# EAGLE design PSocC Motor Driver Design 2 (EAGLE 7.5.0)
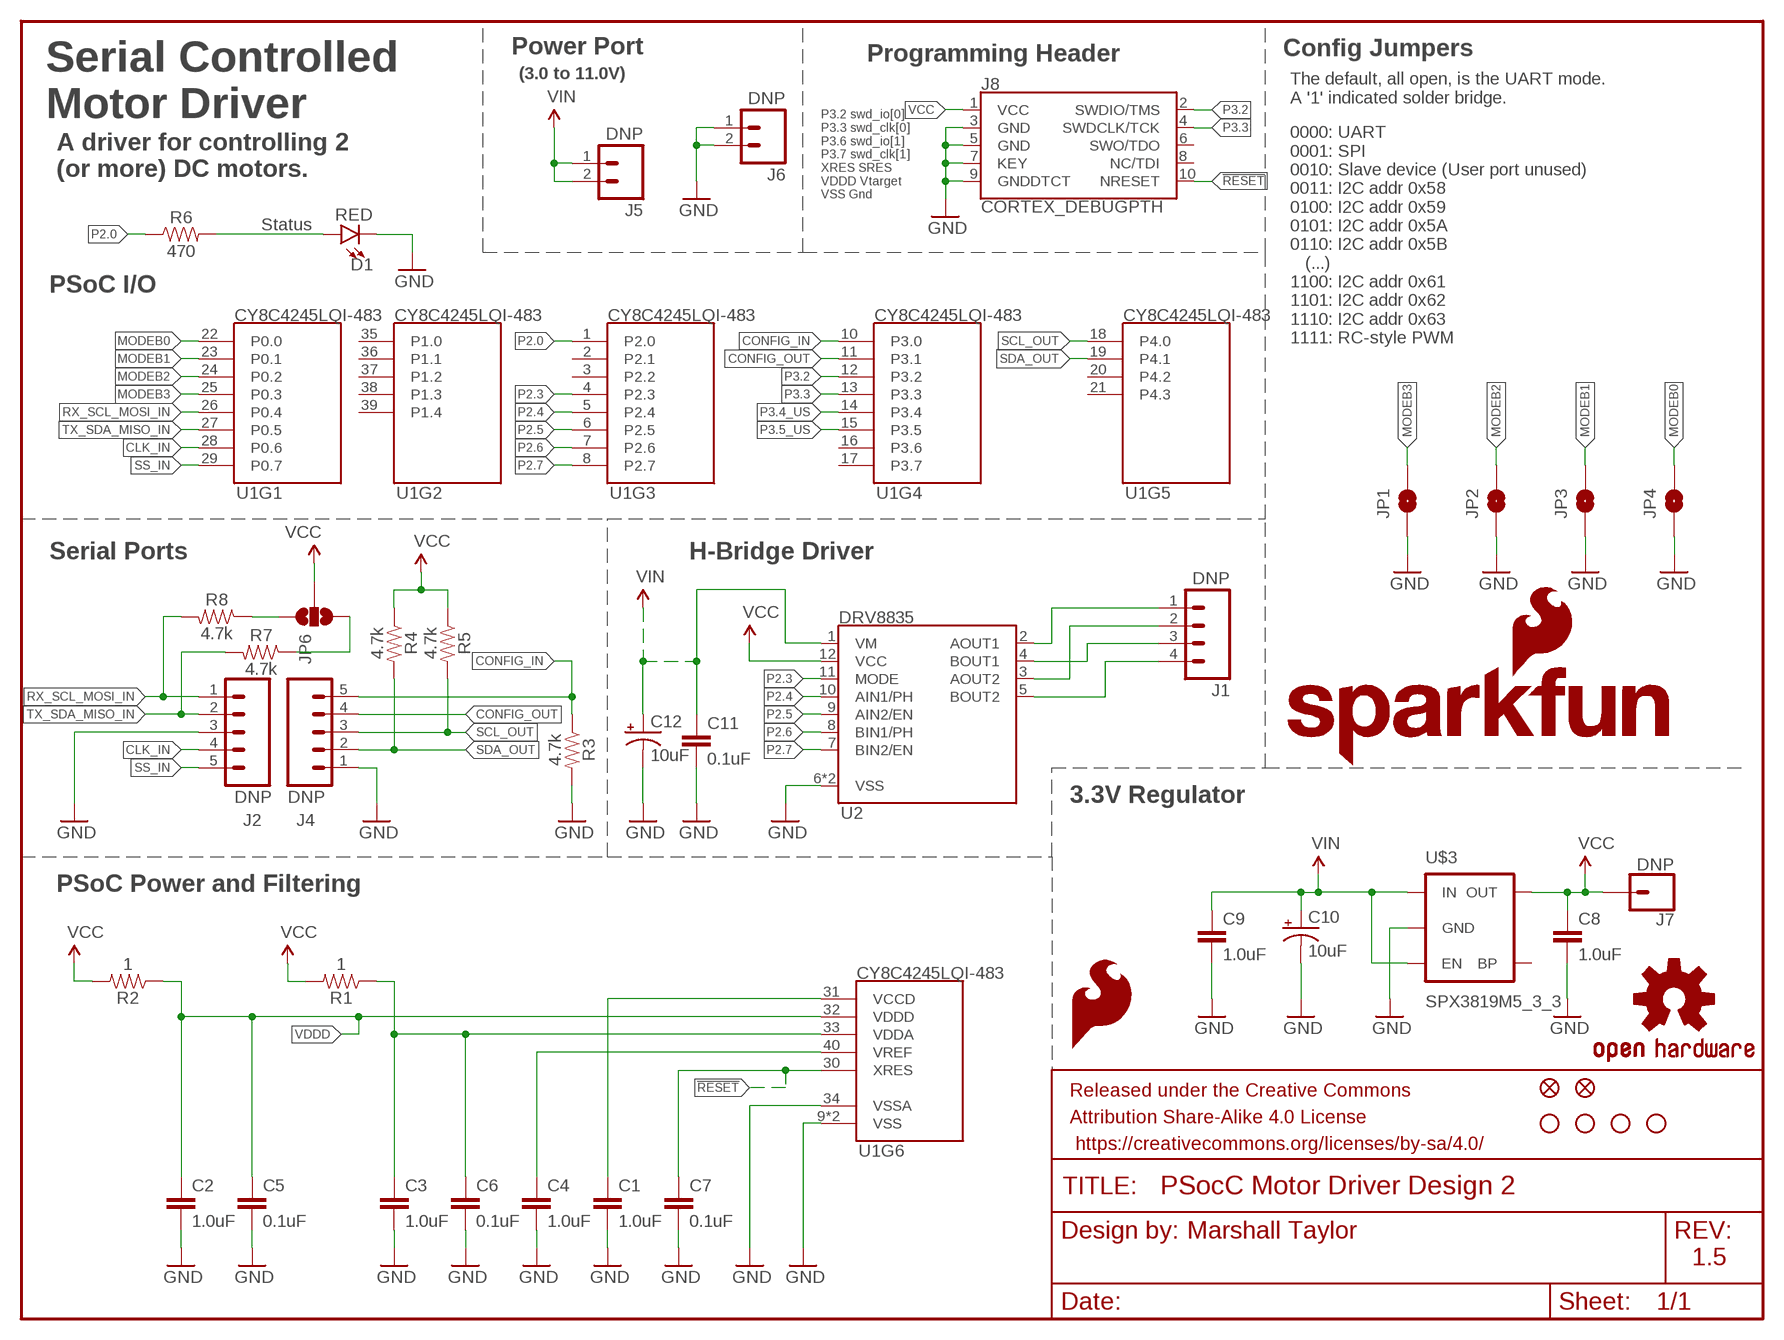
[diagram p0: schematic, sheet 1]

## Parts
C1  1.0uF  1.0UF-0402-16V-10%  [0402]
C2  1.0uF  1.0UF-0402-16V-10%  [0402]
C3  1.0uF  1.0UF-0402-16V-10%  [0402]
C4  1.0uF  1.0UF-0402-16V-10%  [0402]
C5  0.1uF  0.1UF-0402-16V-10%  [0402]
C6  0.1uF  0.1UF-0402-16V-10%  [0402]
C7  0.1uF  0.1UF-0402-16V-10%  [0402]
C8  1.0uF  1.0UF-0402-16V-10%  [0402]
C9  1.0uF  1.0UF-0402-16V-10%  [0402]
C10  10uF  10UF-POLAR-EIA3216-16V-10%(TANT)  [EIA3216]
C11  0.1uF  0.1UF-0402-16V-10%  [0402]
C12  10uF  10UF-POLAR-EIA3216-16V-10%(TANT)  [EIA3216]
D1  RED  LED-RED0603  [LED-0603]
FD1  FIDUCIALUFIDUCIAL  [MICRO-FIDUCIAL]
FD2  FIDUCIALUFIDUCIAL  [MICRO-FIDUCIAL]
FRAME1  FRAME-LETTER  [CREATIVE_COMMONS]
H1  STAND-OFF  [STAND-OFF]
H2  STAND-OFF  [STAND-OFF]
H3  STAND-OFF  [STAND-OFF]
H4  STAND-OFF  [STAND-OFF]
J1  DNP  M04PTH  [1X04]
J2  DNP  M05PTH  [1X05]
J4  DNP  M05PTH  [1X05]
J5  DNP  M02PTH  [1X02]
J6  DNP  M02PTH  [1X02]
J7  DNP  CONN_01PTH  [1X01]
J8  CORTEX_DEBUGPTH  [2X5-PTH-1.27MM]
JP1  JUMPER-PAD-2  JUMPER-PAD-2-NOYES_SILK  [PAD-JUMPER-2-NO_YES_SILK]
JP2  JUMPER-PAD-2  JUMPER-PAD-2-NOYES_SILK  [PAD-JUMPER-2-NO_YES_SILK]
JP3  JUMPER-PAD-2  JUMPER-PAD-2-NOYES_SILK  [PAD-JUMPER-2-NO_YES_SILK]
JP4  JUMPER-PAD-2  JUMPER-PAD-2-NOYES_SILK  [PAD-JUMPER-2-NO_YES_SILK]
JP6  JUMPER-PAD-3-NOYES_SILK  [PAD-JUMPER-3-NO_YES_SILK]
LOGO1  SFE_LOGO_FLAME.1_INCH  [SFE_LOGO_FLAME_.1]
LOGO2  OSHW-LOGOMINI  [OSHW-LOGO-MINI]
LOGO3  SFE_LOGO_NAME_FLAME.1_INCH  [SFE_LOGO_NAME_FLAME_.1]
R1  1  1OHM-0603-1/10W-1%  [0603]
R2  1  1OHM-0603-1/10W-1%  [0603]
R3  4.7k  4.7KOHM-0603-1/10W-1%  [0603]
R4  4.7k  4.7KOHM-0603-1/10W-1%  [0603]
R5  4.7k  4.7KOHM-0603-1/10W-1%  [0603]
R6  470  470OHM-0603-1/10W-1%  [0603]
R7  4.7k  4.7KOHM-0603-1/10W-1%  [0603]
R8  4.7k  4.7KOHM-0603-1/10W-1%  [0603]
U1  CY8C4245LQI-483  CY8C4245LQI  [QFN-40]
U2  DRV8835  DRV883X  [WSON-12]
U$3  SPX3819M5_3_3  SPX3819  [SOT-23-5-VREG]

## Nets
!RESET: C7.1 J8.10(NRESET) U1.30(XRES)
CLK_IN: J2.4 U1.28(P0.6)
CONFIG_IN: J4.5 R3.1 U1.10(P3.0)
CONFIG_OUT: J4.4 U1.11(P3.1)
GND: C1.2 C2.2 C3.2 C4.2 C5.2 C6.2 C7.2 C8.2 C9.2 C10.- C11.2 C12.- D1.C J2.3 J4.1 J6.1 J6.2 J8.3(GND) J8.5(GND) J8.7(KEY) J8.9(GNDDTCT) JP1.1 JP2.1 JP3.1 JP4.1 R3.2 U1.9(VSS) U1.34(VSSA) U1.EP(VSS) U2.6(VSS) U2.PAD(VSS) U$3.2(GND)
MODEB0: JP4.2 U1.22(P0.0)
MODEB1: JP3.2 U1.23(P0.1)
MODEB2: JP2.2 U1.24(P0.2)
MODEB3: JP1.2 U1.25(P0.3)
N$1: C1.1 U1.31(VCCD)
N$3: C3.1 C6.1 R1.1 U1.33(VDDA)
N$4: C4.1 U1.40(VREF)
N$5: J1.1 U2.2(AOUT1)
N$6: J1.2 U2.3(AOUT2)
N$7: J1.3 U2.4(BOUT1)
N$8: J1.4 U2.5(BOUT2)
N$10: D1.A R6.2
N$11: JP6.1 R8.1
N$12: JP6.3 R7.1
P2.0: R6.1 U1.1(P2.0)
P2.3: U1.4(P2.3) U2.11(MODE)
P2.4: U1.5(P2.4) U2.10(AIN1/PH)
P2.5: U1.6(P2.5) U2.9(AIN2/EN)
P2.6: U1.7(P2.6) U2.8(BIN1/PH)
P2.7: U1.8(P2.7) U2.7(BIN2/EN)
P3.2: J8.2(SWDIO/TMS) U1.12(P3.2)
P3.3: J8.4(SWDCLK/TCK) U1.13(P3.3)
P3.4_US: U1.14(P3.4)
P3.5_US: U1.15(P3.5)
RX_SCL_MOSI_IN: J2.1 R8.2 U1.26(P0.4)
SCL_OUT: J4.3 R5.2 U1.18(P4.0)
SDA_OUT: J4.2 R4.2 U1.19(P4.1)
SS_IN: J2.5 U1.29(P0.7)
TX_SDA_MISO_IN: J2.2 R7.2 U1.27(P0.5)
VCC: C8.1 J7.1 J8.1(VCC) JP6.2 R1.2 R2.2 R4.1 R5.1 U2.12(VCC) U$3.5(OUT)
VDDD: C2.1 C5.1 R2.1 U1.32(VDDD)
VIN: C9.1 C10.+ C11.1 C12.+ J5.1 J5.2 U2.1(VM) U$3.1(IN) U$3.3(EN)
Unconnected: J8.6(SWO/TDO) J8.8(NC/TDI) U1.2(P2.1) U1.3(P2.2) U1.16(P3.6) U1.17(P3.7) U1.20(P4.2) U1.21(P4.3) U1.35(P1.0) U1.36(P1.1) U1.37(P1.2) U1.38(P1.3) U1.39(P1.4) U$3.4(BP)

## Notes on the sheet
- Serial Controlled
  Motor Driver
- Power Port | Programming Header | Config Jumpers
- The default, all open, is the UART mode.
  A '1' indicated solder bridge.
- (3.0 to 11.0V)
- P3.2 swd_io[0]
  P3.3 swd_clk[0]
  P3.6 swd_io[1]
  P3.7 swd_clk[1]
  XRES SRES
  VDDD Vtarget
  VSS Gnd
- 0000: UART
  0001: SPI
  0010: Slave device (User port unused)
  0011: I2C addr 0x58
  0100: I2C addr 0x59
  0101: I2C addr 0x5A
  0110: I2C addr 0x5B
     (...)
  1100: I2C addr 0x61
  1101: I2C addr 0x62
  1110: I2C addr 0x63
  1111: RC-style PWM
- A driver for controlling 2
  (or more) DC motors.
- Status
- PSoC I/O
- Serial Ports | H-Bridge Driver
- 3.3V Regulator
- PSoC Power and Filtering
- Marshall Taylor
- 1.5

## Library data of the parts
C1-C4 C8 C9 = SparkFun-Capacitors:1.0UF: 1µF ceramic capacitors A capacitor is a passive two-terminal electrical component used to store electrical energy temporarily in an electric field.; PROD_ID: CAP-12417
C5-C7 C11 = SparkFun-Capacitors:0.1UF: 0.1µF ceramic capacitors A capacitor is a passive two-terminal electrical component used to store electrical energy temporarily in an electric field.; PROD_ID: CAP-12416
C10 C12 = SparkFun-Capacitors:10UF-POLAR: 10.0µF polarized capacitors A capacitor is a passive two-terminal electrical component used to store electrical energy temporarily in an electric field.; PROD_ID: CAP-00811
D1 = SparkFun-LED:LED-RED: Red SMD LED Used in manufacturing of most products at SparkFun Packages: 0603 - SMD 0603 package [Product Link] <http://docs.avagotech.com/docs/AV02-0551EN> 0603 SMART - SMD 0603 SMART package ( more efficient and expensive)[Product Link] <http://www.osram-os.com/Graphics/XPic2/00077099_0.pdf> 1206 - SMD1206 package [Product Link] <https://www.sparkfun.com/datasheets/DevTools/LilyPad/Q150OVS4.pdff> SparkFun Products: Pro Mini 328 -5V <https://www.sparkfun.com/products/821> RedBoard <https://www.sparkfun.com/products/12757> IOIO-OTG <https://www.sparkfun.com/products/13613>; PROD_ID: DIO-00819
FD1 FD2 = SparkFun-Aesthetics:FIDUCIAL: Fiducial Alignment Points Various fiducial points for machine vision alignment.
FRAME1 = SparkFun-Aesthetics:FRAME-LETTER: Schematic Frame Standard 8.5x11 US Letter frame
H1-H4 = SparkFun-Electromechanical:STAND-OFF: #4 Stand Off This is the mechanical footprint for a #4 phillips button head screw. Use the keepout ring to avoid running the screw head into surrounding components. SKU : PRT-00447
J1 = SparkFun-Connectors:M04: Header 4 Standard 4-pin 0.1" header. Use with straight break away headers (SKU : PRT-00116), right angle break away headers (PRT-00553), swiss pins (PRT-00743), machine pins (PRT-00117), and female headers (PRT-00115). Molex polarized connector foot print use with SKU : PRT-08231 with associated crimp pins and housings. 1MM SMD Version SKU: PRT-10208; PROD_ID: CONN-09696
J2 J4 = SparkFun-Connectors:M05: Header 5 Standard 5-pin 0.1" header. Use with straight break away headers (SKU : PRT-00116), right angle break away headers (PRT-00553), swiss pins (PRT-00743), machine pins (PRT-00117), and female headers (PRT-00115). Molex polarized connector foot print use with SKU : PRT-08230 with associated crimp pins and housings.
J5 J6 = SparkFun-Connectors:M02: Standard 2-pin 0.1" header. Use with - straight break away headers ( PRT-00116) - right angle break away headers (PRT-00553) - swiss pins (PRT-00743) - machine pins (PRT-00117) - female headers (PRT-00115) Molex polarized connector foot print use with: PRT-08233 with associated crimp pins and housings. 2.54_SCREWTERM for use with PRT-10571. 3.5mm Screw Terminal footprints for PRT-08084 5mm Screw Terminal footprints for use with PRT-08432
J7 = SparkFun-Connectors:CONN_01: Header 1 Standard 1-pin 0.1" header. Use with straight break away headers (SKU : PRT-00116), right angle break away headers (PRT-00553), swiss pins (PRT-00743), machine pins (PRT-00117), and female headers (PRT-00115). SMTSO-256-ET is a "flush mount" nut for a 4-40 screw. The older package used to be too tight, and did not allow it to sit properly thru the drill hit. The latest (0.165DIA) fits nice and snug.
J8 = Pete_Connectors_Retired:CORTEX_DEBUG: Cortex Debug Connector Datasheet <http://infocenter.arm.com/help/topic/com.arm.doc.faqs/attached/13634/cortex_debug_connectors.pdf>
JP1-JP4 = SparkFun-Passives:JUMPER-PAD-2-NO
JP6 = SparkFun-Passives:JUMPER-PAD-3-NO
LOGO1 = SparkFun-Aesthetics:SFE_LOGO_FLAME: SFE Logo, flame only This is the SparkFun flame logo. The logo on the schematic will always be the same size; the package variant is the height of the flame. Default layer for the logo on the board is tSilk.
LOGO2 = SparkFun-Aesthetics:OSHW-LOGO: Open Source Hardware Logo This logo indicates the piece of hardware it is found on incorporates a OSHW license and/or adheres to the definition of open source hardware found here: http://freedomdefined.org/OSHW
LOGO3 = SparkFun-Aesthetics:SFE_LOGO_NAME_FLAME: SFE Logo, name and flame This is the SparkFun full logo. The logo on the schematic will always be the same size; the package variant is the height of the flame part of the logo. Default layer for the logo on the board is tSilk.
R1 R2 = SparkFun-Resistors:1OHM: 1Ω resistor A resistor is a passive two-terminal electrical component that implements electrical resistance as a circuit element. Resistors act to reduce current flow, and, at the same time, act to lower voltage levels within circuits.; PROD_ID: RES-08269
R3-R5 R7 R8 = SparkFun-Resistors:4.7KOHM: 4.7kΩ resistor A resistor is a passive two-terminal electrical component that implements electrical resistance as a circuit element. Resistors act to reduce current flow, and, at the same time, act to lower voltage levels within circuits.; PROD_ID: RES-07857
R6 = SparkFun-Resistors:470OHM: 470Ω resistor A resistor is a passive two-terminal electrical component that implements electrical resistance as a circuit element. Resistors act to reduce current flow, and, at the same time, act to lower voltage levels within circuits.; PROD_ID: RES-07869
U1 = PSOC4TempLib:CY8C4245LQI: PSOC 4200; PROD_ID: IC-13292
U2 = PSOC4TempLib:DRV883X; PROD_ID: IC-13342
U$3 = PSOC4TempLib:SPX3819; PROD_ID: VREG-13321

## Board
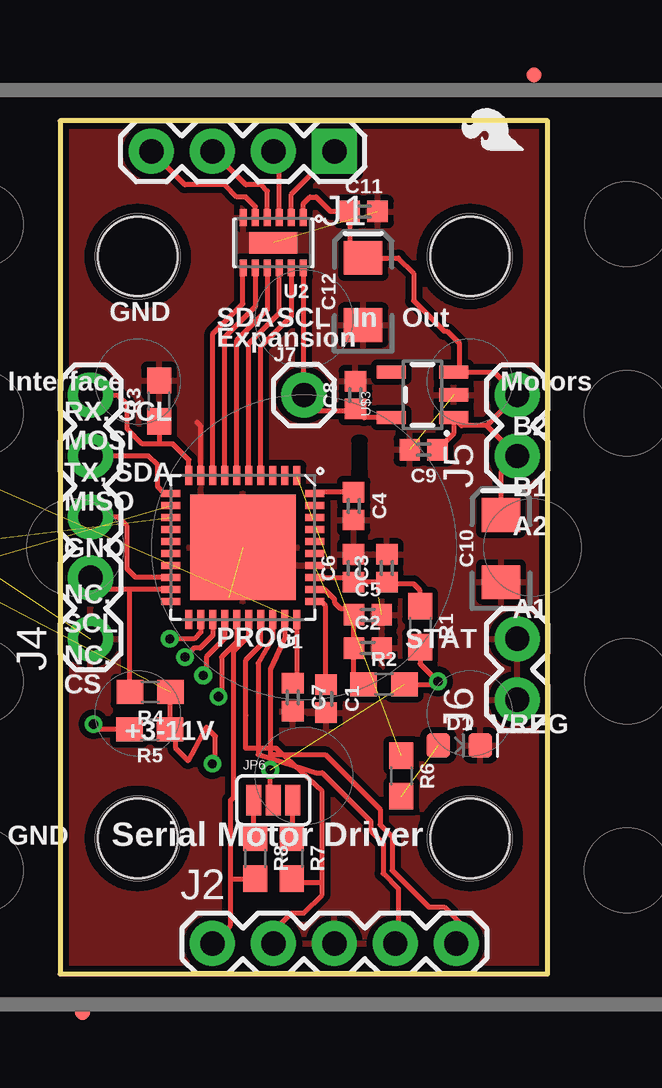
[diagram p1: board, top side]
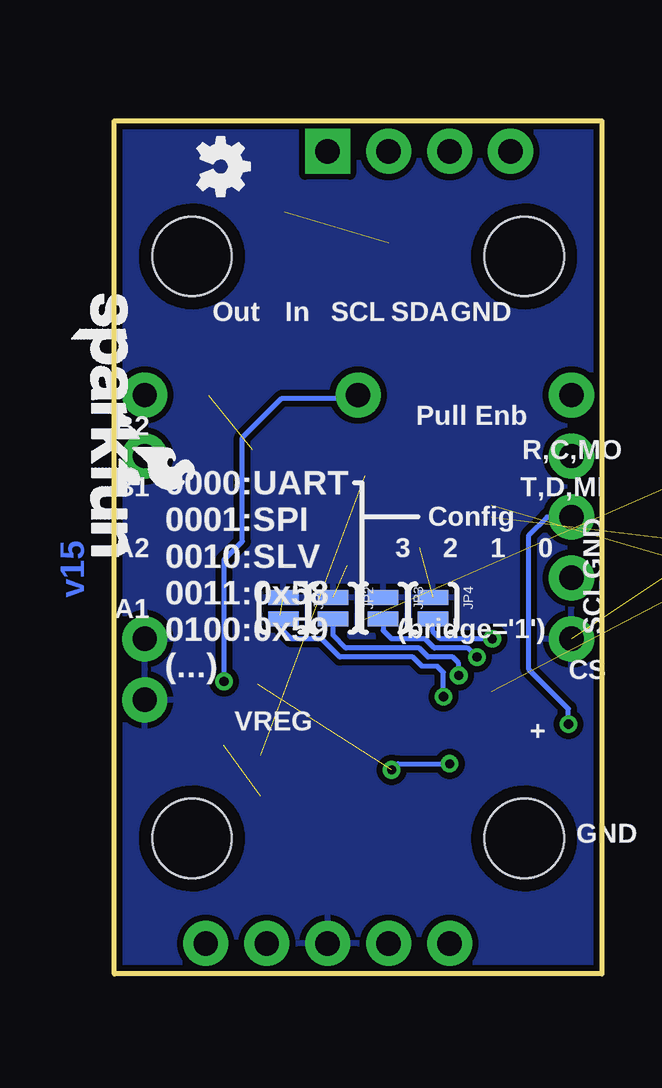
[diagram p2: board, bottom side, seen from below]

Size 20.32 x 35.56 mm. Coordinates in mm from the lower left corner, seen from the top.
Outline: 0,0 20.32,0 20.32,35.56 0,35.56 0,0
Copper layers (1*16): Top 0.035mm / dielectric 1.5mm / Bottom 0.035mm
Design rules "SparkFun-2-layer-TIGHT": minimum track width 7mil, minimum drill 15mil, track to track 7mil, track to pad 7mil, pad to pad 7mil, via to via 7mil, smd to smd 7mil, copper to edge 7mil, drill to drill 7mil, minimum pad ring 7mil, minimum via ring 7mil, stop-mask expansion 4mil, vias tented up to drill 25mil, thermal gap 10mil
tRestrict: area 9.5,23.8 to 10.8,24; area 9.6,19.2 to 10.8,19.4; area 7.7,21 to 7.9,22.2; area 12.4,21 to 12.6,22.2

### Footprints (pad centres in the part's own frame; a part is rotated, then mirrored left to right if it is on the bottom)
0402 = smd 0.85 x 0.9: 1 -0.58,0; 2 0.58,0
EIA3216 = smd 1.4 x 1.6: + 1.4,0; - -1.4,0
LED-0603 = smd 1 x 1: A -0.877,0; C 0.877,0
MICRO-FIDUCIAL = smd 0.635 x 0.635: 1 0,0
STAND-OFF = hole 3.302: 0,0
1X04 = drill 1.016 pad 1.88 square: 1 0,0 | drill 1.016 pad 1.88: 2 2.54,0; 3 5.08,0; 4 7.62,0
1X05 = drill 1.016 pad 1.88: 1 0,0; 2 2.54,0; 3 5.08,0; 4 7.62,0; 5 10.16,0
1X02 = drill 1.016 pad 1.88: 1 0,0; 2 2.54,0
1X01 = drill 1.016 pad 1.88: 1 0,0
2X5-PTH-1.27MM = drill 0.508 pad 1: 1 -2.54,-0.635; 2 -2.54,0.635; 3 -1.27,-0.635; 4 -1.27,0.635; 5 0,-0.635; 6 0,0.635; 7 1.27,-0.635; 8 1.27,0.635; 9 2.54,-0.635; 10 2.54,0.635
PAD-JUMPER-2-NO_YES_SILK = smd 0.635 x 1.27: 1 -0.45,0; 2 0.45,0
PAD-JUMPER-3-NO_YES_SILK = smd 0.635 x 1.27: 1 -0.813,0; 2 0,0; 3 0.813,0
0603 = smd 1.1 x 1: 1 -0.85,0; 2 0.85,0
QFN-40 = smd 0.285 x 0.8: 1 -2.25,-3; 2 -1.75,-3; 3 -1.25,-3; 4 -0.75,-3; 5 -0.25,-3; 6 0.25,-3; 7 0.75,-3; 8 1.25,-3; 9 1.75,-3; 10 2.25,-3; 21 2.25,3; 22 1.75,3; 23 1.25,3; 24 0.75,3; 25 0.25,3; 26 -0.25,3; 27 -0.75,3; 28 -1.25,3; 29 -1.75,3; 30 -2.25,3 | smd 0.8 x 0.285: 11 3,-2.25; 12 3,-1.75; 13 3,-1.25; 14 3,-0.75; 15 3,-0.25; 16 3,0.25; 17 3,0.75; 18 3,1.25; 19 3,1.75; 20 3,2.25; 31 -3,2.25; 32 -3,1.75; 33 -3,1.25; 34 -3,0.75; 35 -3,0.25; 36 -3,-0.25; 37 -3,-0.75; 38 -3,-1.25; 39 -3,-1.75; 40 -3,-2.25 | smd 4.4 x 4.4: EP 0,0
WSON-12 = smd 0.3 x 0.7: 1 -1.25,-1.05; 2 -0.75,-1.05; 3 -0.25,-1.05; 4 0.25,-1.05; 5 0.75,-1.05; 6 1.25,-1.05; 7 1.25,1.05; 8 0.75,1.05; 9 0.25,1.05; 10 -0.25,1.05; 11 -0.75,1.05; 12 -1.25,1.05 | smd 2 x 0.9: PAD 0,0
SOT-23-5-VREG = smd 0.55 x 1.2: 1 -0.95,-1.3; 2 0,-1.3; 3 0.95,-1.3; 4 0.95,1.3; 5 -0.95,1.3

### Placement (x,y rotation side)
C1  11.09,11.47 270 top
C2  12.83,13.58 0 top
C3  13.62,16.91 90 top
C4  12.23,19.5 270 top
C5  12.83,14.97 0 top
C6  12.23,16.91 90 top
C7  9.7,11.53 270 top
C8  12.31,24.13 90 top
C9  15.15,21.85 180 top
C10  18.38,17.73 90 top
C11  12.65,31.78 0 top
C12  12.63,28.45 90 top
D1  16.64,9.53 0 top
FD1  0.93,-1.61 90 top
FD2  19.75,37.46 90 top
FRAME1  -20.32,-13.97 0 top  (outside the outline)
H1  17.08,5.65 0 top
H2  3.24,29.91 0 top
H3  17.08,29.91 0 top
H4  3.24,5.65 0 top
J1  11.43,34.29 180 top
J2  6.35,1.27 0 top
J4  1.27,13.97 90 top
J5  19.05,21.59 90 top
J6  19.05,11.43 90 top
J7  10.16,24.13 0 top
J8  -5.08,19.05 90 top  (outside the outline)
JP1  13.28,15.25 270 bottom
JP2  11.2,15.25 270 bottom
JP3  9.12,15.25 270 bottom
JP4  7.04,15.25 270 bottom
JP6  8.89,7.24 0 top
LOGO1  19.65,34.04 90 top
LOGO2  15.88,33.66 270 bottom
LOGO3  22.19,28.77 270 bottom
R1  15.01,14.48 270 top
R2  13.5,12.07 0 top
R3  4.13,23.88 90 top
R4  3.76,11.76 180 top
R5  3.74,10.18 180 top
R6  14.22,8.25 270 top
R7  9.65,4.83 270 top
R8  8.13,4.83 270 top
U1  7.62,17.78 180 top
U2  8.89,30.48 180 top
U$1  [ACTOBOTICS_CHANNEL_SINGLE_DRILL_REF]  -8.89,-1.27 0 top  (outside the outline)
U$3  15.11,24.14 90 top

### Tracks (layer width: path | path; a pad name or v marks a point on that pad's centre or on a via)
!RESET  (1 unrouted)
  Top 0.203: U1.30 9.87,12.28 C7.1
CLK_IN
  Top 0.203: U1.28 8.87,13.99 8.25,12.95 8.25,9.14 10.67,8.38 10.92,8.38 12.95,6.35 12.95,5.97 13.46,5.46 13.46,4.19 14.1,3.56 14.1,1.4 J2.4
CONFIG_IN
  Top 0.203: J4.5 2.41,24.13 2.79,23.75 2.79,22.73 3.43,22.1 4.06,22.1 | U1.10 5.37,21.43 4.7,22.1 4.06,22.1 | R3.1 4.13,22.16 4.06,22.1
CONFIG_OUT
  Top 0.203: U1.11 4.35,20.03 4.06,20.32 4.06,21.21 3.68,21.59 J4.4
GND  (6 unrouted)
  Top 0.203: U1.9 5.87,22.83 5.72,22.99
  pour Top (isolate 0.254, rank 2): -10.16,38.1 -10.16,-2.54 30.48,-2.54 30.48,38.1
  pour Bottom (isolate 0.254): -10.16,38.1 -10.16,-2.54 30.48,-2.54 30.48,38.1
MODEB0  (via drill 0.38)
  Top 0.203: U1.22 5.87,14.25 5.59,13.97 v4.57,13.97
  Bottom 0.203: v4.57,13.97 6.73,13.97 7.04,14.28 JP4.2
MODEB1  (via drill 0.38)
  Top 0.203: U1.23 6.37,14.12 5.84,13.59 5.59,13.59 v5.21,13.21
  Bottom 0.203: v5.21,13.21 5.59,13.59 6.99,13.59 7.37,13.97 8.76,13.97 9.12,14.33 JP3.2
MODEB2  (via drill 0.38)
  Top 0.203: U1.24 6.87,13.98 6.1,13.21 6.1,12.57 v5.97,12.45
  Bottom 0.203: v5.97,12.45 5.97,12.95 6.22,13.21 7.24,13.21 7.62,13.59 10.67,13.59 11.2,14.12 JP2.2
MODEB3  (via drill 0.38)
  Top 0.203: U1.25 7.37,13.85 6.73,13.21 6.73,11.68 v6.6,11.56
  Bottom 0.203: v6.6,11.56 6.6,12.57 6.86,12.83 7.49,12.83 7.87,13.21 10.92,13.21 11.68,13.97 12.95,13.97 13.28,14.29 JP1.2
N$1
  Top 0.203: U1.31 10.89,15.53 11.05,15.37 11.05,12.09 C1.1
N$3
  Top 0.203: R1.1 15.01,15.98 14.73,16.26 13.7,16.26 C3.1 C6.1 12.04,16.53 U1.33
N$4
  Top 0.203: C4.1 10.67,20.08 U1.40
N$5
  Top 0.203: U2.2 9.64,32.5 J1.1
N$6
  Top 0.203: U2.3 9.14,34.04 J1.2
N$7
  Top 0.203: U2.4 8.64,32.63 8.38,32.89 7.75,32.89 J1.3
N$8
  Top 0.203: U2.5 8.14,31.99 7.75,32.38 7.37,32.38 6.86,32.89 5.21,32.89 J1.4
N$10  (1 unrouted)
N$11
  Top 0.203: R8.1 8.08,5.73 JP6.1
N$12
  Top 0.203: R7.1 9.7,5.73 JP6.3
P2.0  (1 unrouted)
P2.3
  Top 0.203: U1.4 8.37,26.15 9.64,27.42 U2.11
P2.4
  Top 0.203: U1.5 7.87,26.28 9.14,27.55 U2.10
P2.5
  Top 0.203: U1.6 7.37,26.42 8.64,27.69 U2.9
P2.6
  Top 0.203: U1.7 6.87,26.55 8.14,27.83 U2.8
P2.7
  Top 0.203: U1.8 6.37,26.69 7.62,27.94 7.62,29.41 U2.7
P3.2  (1 unrouted)
P3.3  (1 unrouted)
RX_SCL_MOSI_IN
  Top 0.203: J2.1 7.11,2.03 7.11,3.94 | 7.11,3.94 7.11,7.24 7.24,7.37 7.24,13.46 7.87,14.09 U1.26 | R8.2 8.09,3.94 7.11,3.94
SCL_OUT  (via drill 0.38)
  Top 0.203: U1.18 3.16,16.53 2.79,16.89 2.79,18.67 2.41,19.05 J4.3 | R5.2 1.63,10.18 v1.4,10.41
  Bottom 0.203: v1.4,10.41 1.4,11.05 3.05,12.7 3.05,18.29 2.29,19.05 J4.3
SDA_OUT
  Top 0.203: U1.19 2.92,16.03 | 2.92,16.03 1.75,16.03 J4.2 | R4.2 2.91,16.02 2.92,16.03
SS_IN
  Top 0.203: U1.29 9.37,14 8.76,12.7 8.76,9.14 11.05,9.14 13.34,6.86 13.34,6.22 13.84,5.71 13.84,4.32 15.37,2.79 16,2.79 16.64,2.16 16.64,1.4 J2.5
TX_SDA_MISO_IN
  Top 0.203: J2.2 8.89,1.78 9.65,2.54 10.16,2.54 10.92,3.3 10.92,3.81 | 10.92,3.81 10.92,7.62 9.14,9.27 9,9.41 7.74,9.41 7.75,10.79 7.75,13.08 8.37,13.7 U1.27 | R7.2 9.82,3.81 10.92,3.81
VCC  (via drill 0.38)  (2 unrouted)
  Top 0.203: U$3.5 12.67,23.19 C8.1 12.26,23.49 10.67,23.49 10.16,24 J7.1 10.16,29.41 U2.12 | R4.1 4.59,11.74 R5.1 4.83,9.95 4.83,9.4 5.33,8.89 6.1,10.29 6.48,9.91 6.48,8.89 v6.35,8.76 | JP6.2 8.76,7.37 v8.76,8.51 | R2.2 15.63,12.07 v15.75,12.19 15.01,12.93 R1.2
  Bottom 0.203: v8.76,8.51 8.51,8.76 v6.35,8.76 | v15.75,12.19 15.75,17.27 14.99,18.03 14.99,22.35 13.34,24 10.29,24 J7.1
VDDD
  Top 0.203: R2.1 12.25,12.48 C2.1 C5.1 11.98,15.24 11.68,15.24 11.43,15.49 11.43,15.62 11.02,16.03 U1.32
VIN
  Top 0.203: U2.1 10.14,32.11 10.41,32.38 10.67,32.38 11.27,31.78 C11.1 12.07,30.4 C12.+ 14.09,29.85 14.73,29.21 14.73,28.07 16,26.8 16.13,26.8 16.64,26.29 16.64,25.32 U$3.3 18.09,25.09 J5.2 17.78,22.86 | C9.1 16.41,22.52 U$3.1 16.73,22.86 17.78,22.86 | 17.78,22.86 J5.1 18.38,20.91 C10.+

### Text on the board
Bottom: v15
tPlace: GND | SDA | SCL | In | Out | Expansion | Interface | Motors | RX, SCL / MOSI | B2 | TX, SDA / MISO | B1 | A2 | GND | NC, / SCL | A1 | PROG | STAT | NC, / CS | +3-11V | VREG | GND | Serial Motor Driver
bPlace: GND | SDA | SCL | In | Out | Pull Enb | B2 | R,C,MO | T,D,MI | B1 | GND | Config | 0 | 1 | 2 | 3 | A2 | 0000:UART / 0001:SPI / 0010:SLV / 0011:0x58 / 0100:0x59 / (...) | SCL | A1 | (bridge='1') | CS | + | VREG | GND
Measures: Measurements in inches.
tDocu: Marshall Taylor